# Altium schematic sheet ws2812_2020_breakout.SchDoc
size A
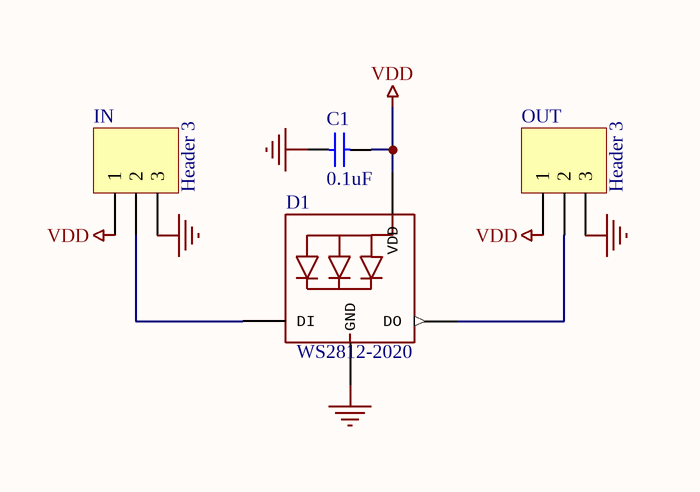
[diagram p0: ws2812_2020_breakout.SchDoc]

## Parts
C1  value 0.1uF  [CAP_0402R]
D1  WS2812-2020  [WS2812-2020]
IN  Header 3  [HDR1X3]
OUT  Header 3  [HDR1X3]

## Nets
GND: C1.1 D1.2(GND) IN.3 OUT.3
VDD: C1.2 D1.4(VDD) IN.1 OUT.1
NetD1_1: D1.1(DO) OUT.2
NetD1_3: D1.3(DI) IN.2

## Library data of the parts
C1 = CAP: Capacitor
D1 = WS2812-2020: Intelligent control LED integrated light source, low current, 2020 package; Manufacturer: Worldsemi; MPN: WS2812-2020
IN OUT = Header 3: Header, 3-Pin